# EasyEDA schematic schemetics.json
TITLE: Sheet_1; REV: 1.0; Date: 2020-12-05; Sheet: 1/1; Company: Your Company
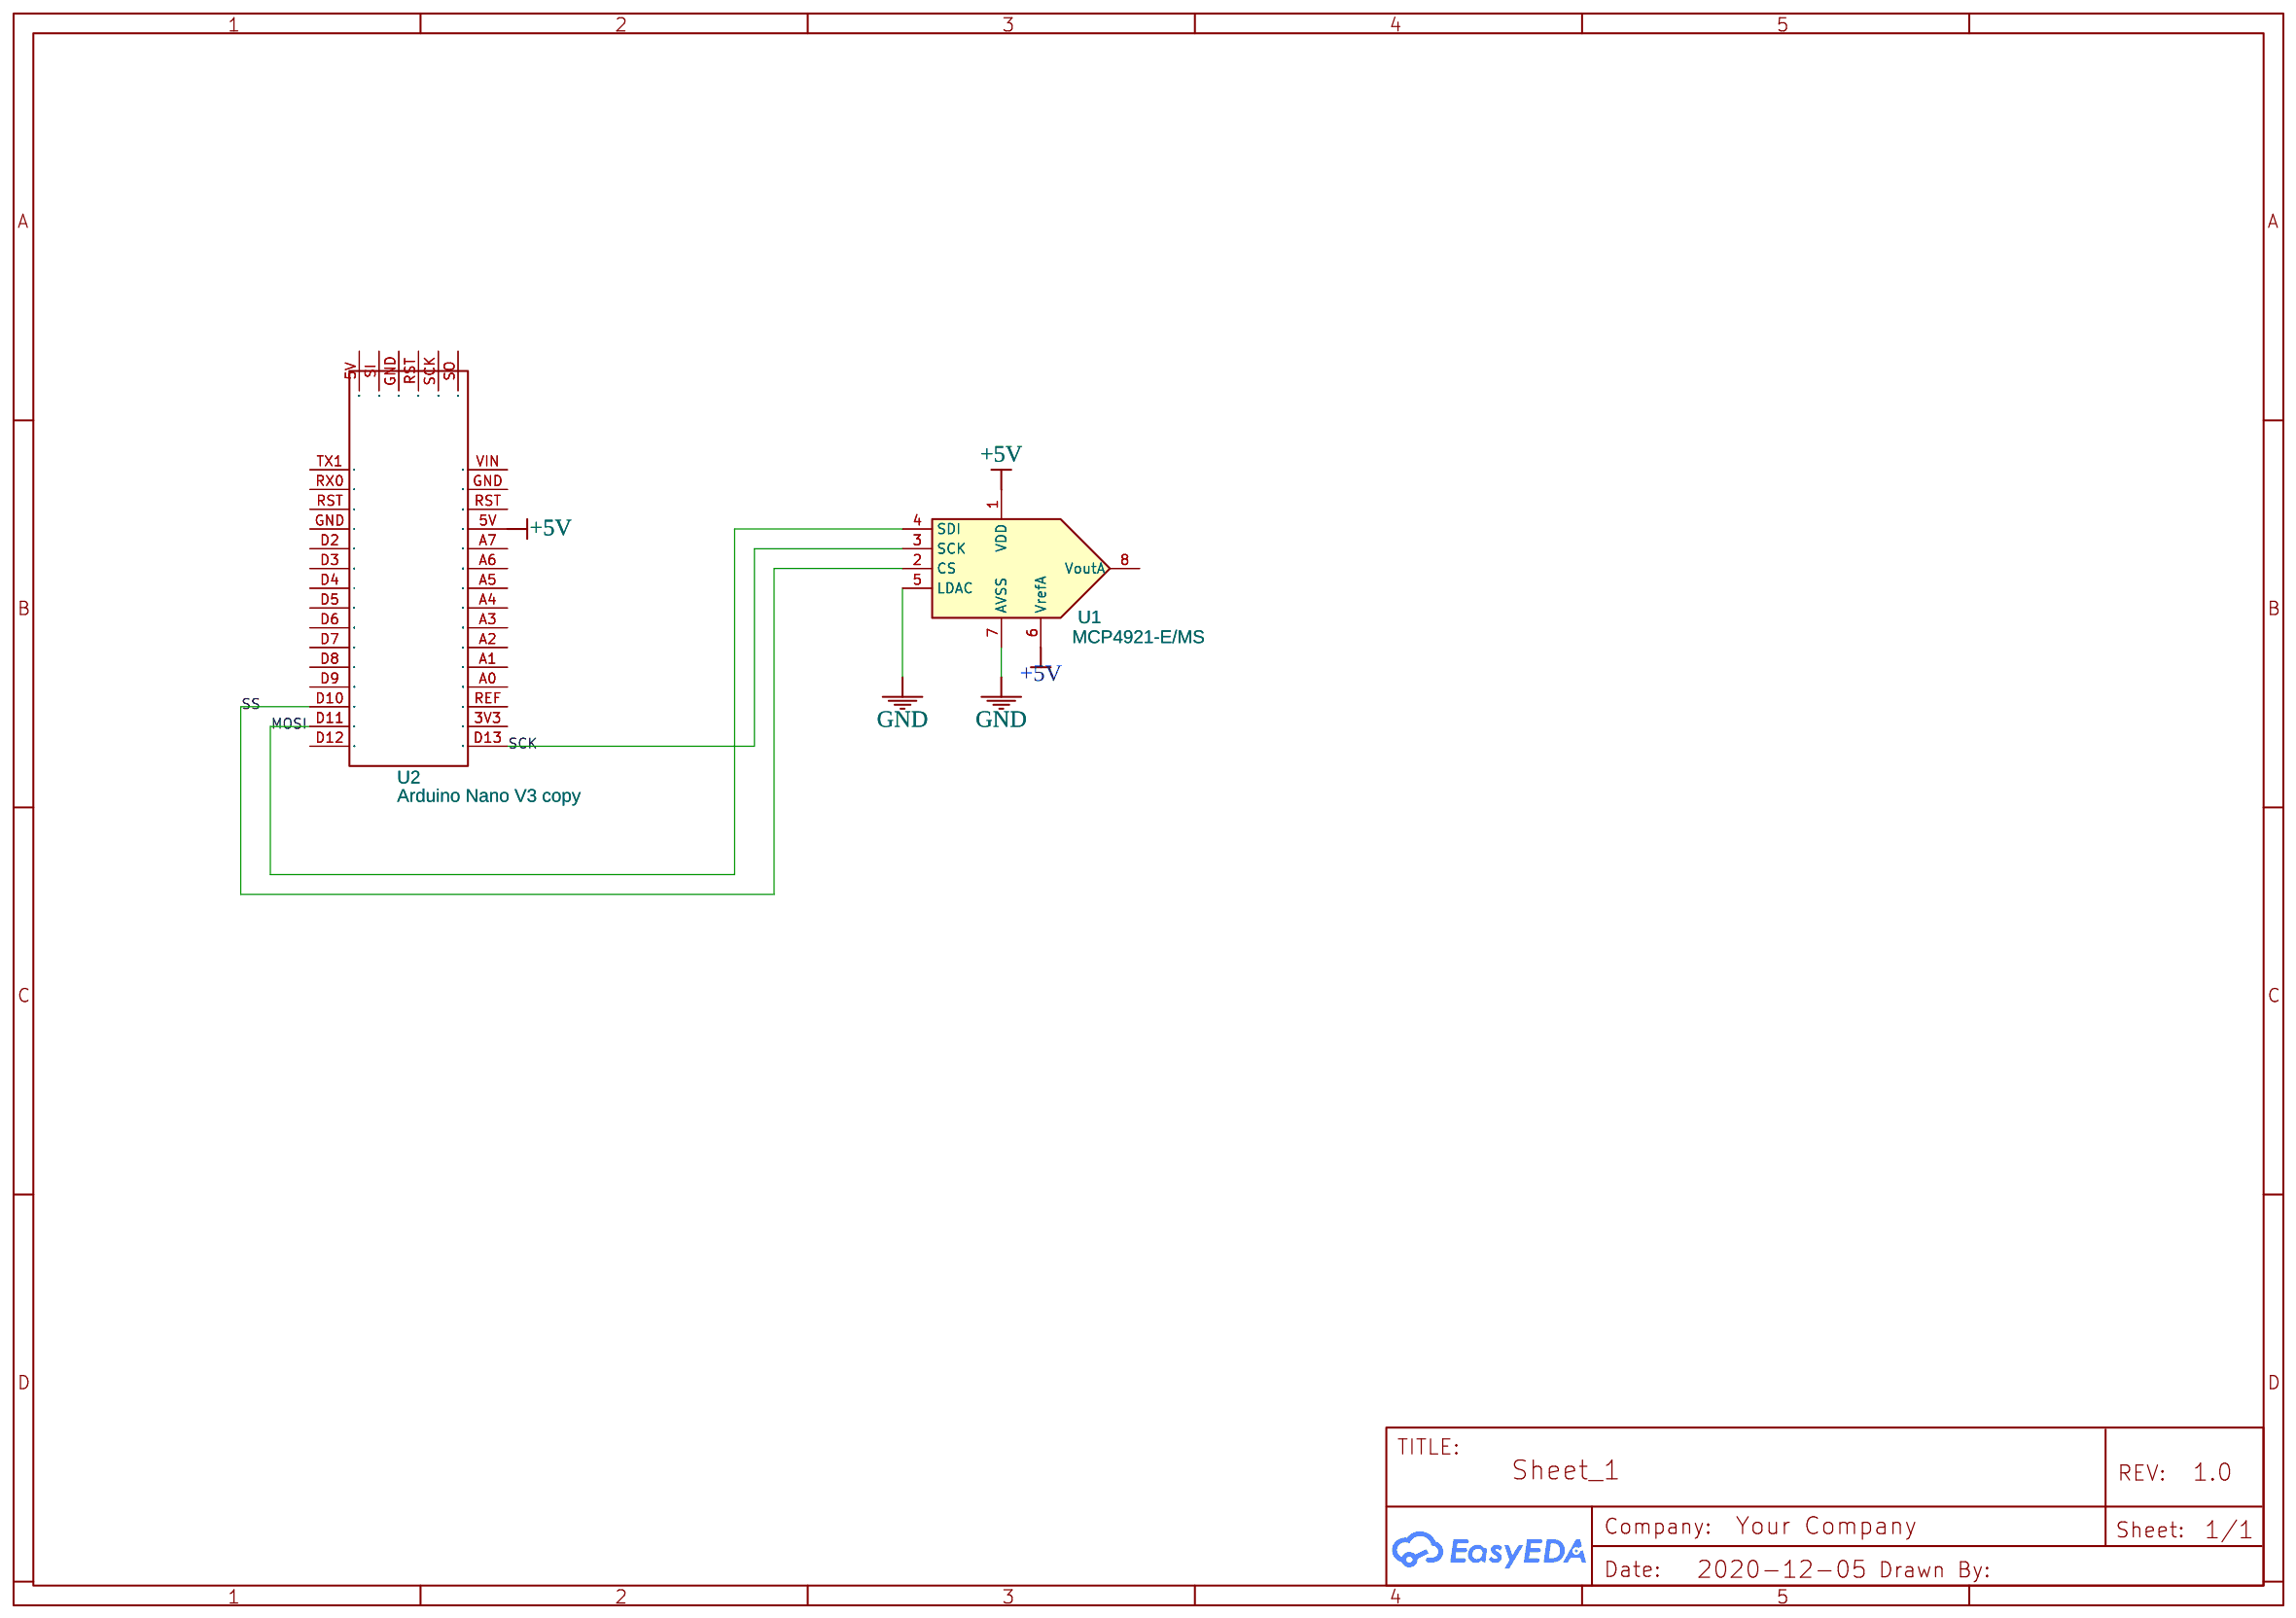
[diagram p0: schematic sheet]

## Parts
U1  MCP4921-E/MS
U2  Arduino Nano V3 copy  [ARDUINO NANO V3]

## Library data of the parts
U1 = MCP4921-E/MS: Contributor: KiCAD; license: https://www.gnu.org/licenses/lgpl-2.1.html
U2 = Arduino Nano V3 copy: Manufacturer Part: Arduino Nano V3; Contributor: rampage-128

## Nets
+5V: U1.1(VDD) U1.6(VrefA) U2.5V(36)
GND: U1.5(LDAC) U1.7(AVSS)
MOSI: U1.4(SDI) U2.D11(14)
SCK: U1.3(SCK) U2.D13(16)
SS: U1.2(CS) U2.D10(13)

Not connected (* = marked no-connect by the designer): U1 8(VoutA); U2 3V3(17) A0(19) A1(20) A2(21) A3(22) A4(23) A5(24) A6(25) A7(26) D2(5) D3(6) D4(7) D5(8) D6(9) D7 D8(11) D9(12) D12(15) GND(34) REF(18) RST(33) RX0(2) SCK(32) SI(35) SO(31) TX1(1) VIN(30)
